# EAGLE design ps2_atmega32_ board_with connector_shogini_5_eagle7x (EAGLE 7.7.0)
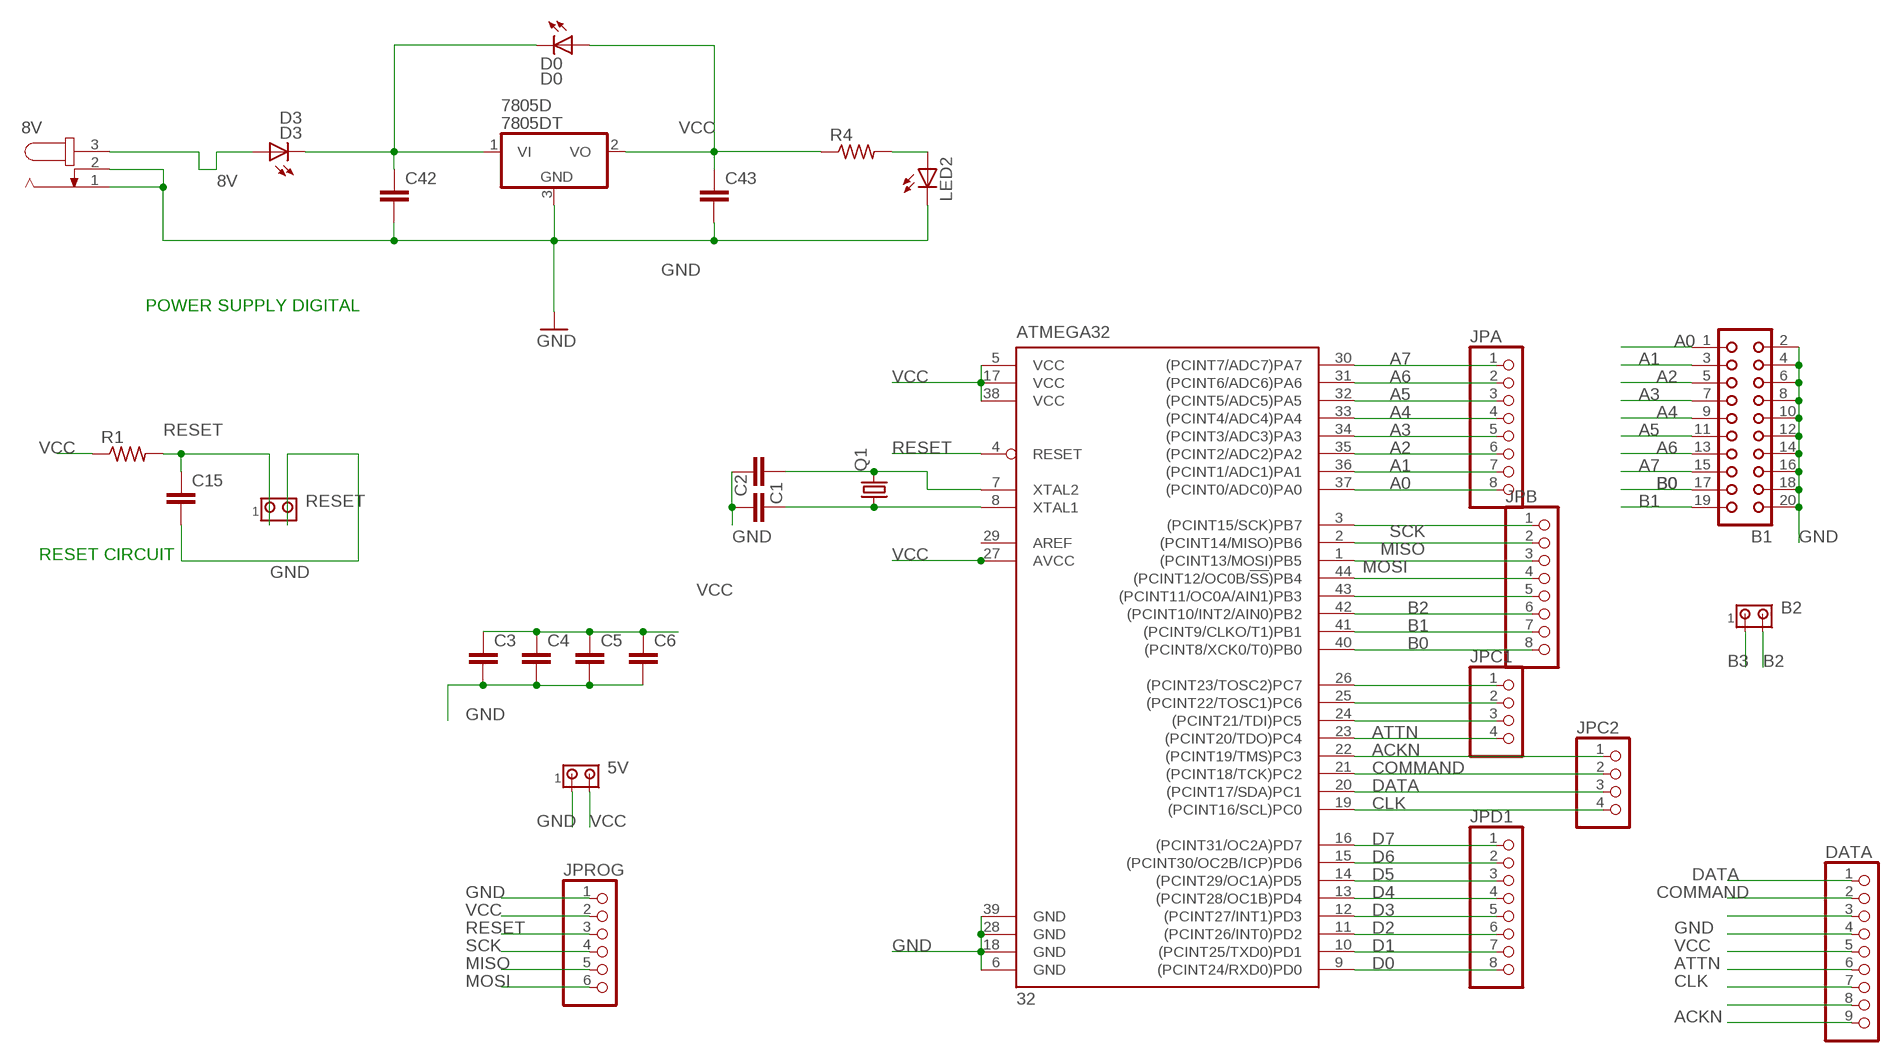
[diagram p0: schematic, sheet 1]

## Parts
5V  MTA02-100  [10X02MTA]
8V  JACK-PLUG0  [SPC4077]
7805D  7805DT  [TO252]
ATMEGA32  32  ATMEGA644A  [TQFP44]
B1  CON20L  [CON20L]
B2  MTA02-100  [10X02MTA]
C1  C-EUC0603K  [C0603K]
C2  C-EUC0603K  [C0603K]
C3  C-EUC0603K  [C0603K]
C4  C-EUC0603K  [C0603K]
C5  C-EUC0603K  [C0603K]
C6  C-EUC0603K  [C0603K]
C15  C-EUC0603  [C0603]
C42  C-EUC0603  [C0603]
C43  C-EUC0603  [C0603]
D0  D0  LEDCHIPLED_1206  [CHIPLED_1206]
D3  D3  LEDCHIPLED_1206  [CHIPLED_1206]
DATA  PINHD-1X9  [1X09]
JPA  PINHD-1X8  [1X08]
JPB  PINHD-1X8  [1X08]
JPC1  PINHD-1X4  [1X04]
JPC2  PINHD-1X4  [1X04]
JPD1  PINHD-1X8  [1X08]
JPROG  PINHD-1X6  [1X06]
LED2  LEDCHIPLED_1206  [CHIPLED_1206]
Q1  CRYSTALHC49S  [HC49/S]
R1  R-US_R0603  [R0603]
R4  R-US_R0603  [R0603]
RESET  MTA02-100  [10X02MTA]

## Nets
8V: 8V.3 D3.A
A0: ATMEGA32.37((PCINT0/ADC0)PA0) B1.1 JPA.8
A1: ATMEGA32.36((PCINT1/ADC1)PA1) B1.3 JPA.7
A2: ATMEGA32.35((PCINT2/ADC2)PA2) B1.5 JPA.6
A3: ATMEGA32.34((PCINT3/ADC3)PA3) B1.7 JPA.5
A4: ATMEGA32.33((PCINT4/ADC4)PA4) B1.9 JPA.4
A5: ATMEGA32.32((PCINT5/ADC5)PA5) B1.11 JPA.3
A6: ATMEGA32.31((PCINT6/ADC6)PA6) B1.13 JPA.2
A7: ATMEGA32.30((PCINT7/ADC7)PA7) B1.15 JPA.1
ACKN: ATMEGA32.22((PCINT19/TMS)PC3) DATA.9 JPC2.1
ATTN: ATMEGA32.23((PCINT20/TDO)PC4) DATA.6 JPC1.4
B0: ATMEGA32.40((PCINT8/XCK0/T0)PB0) B1.17 JPB.8
B1: ATMEGA32.41((PCINT9/CLKO/T1)PB1) B1.19 JPB.7
B2: ATMEGA32.42((PCINT10/INT2/AIN0)PB2) B2.2 JPB.6
B3: ATMEGA32.43((PCINT11/OC0A/AIN1)PB3) B2.1 JPB.5
CLK: ATMEGA32.19((PCINT16/SCL)PC0) DATA.7 JPC2.4
COMMAND: ATMEGA32.21((PCINT18/TCK)PC2) DATA.2 JPC2.2
D0: ATMEGA32.9((PCINT24/RXD0)PD0) JPD1.8
D1: ATMEGA32.10((PCINT25/TXD0)PD1) JPD1.7
D2: ATMEGA32.11((PCINT26/INT0)PD2) JPD1.6
D3: ATMEGA32.12((PCINT27/INT1)PD3) JPD1.5
D4: ATMEGA32.13((PCINT28/OC1B)PD4) JPD1.4
D5: ATMEGA32.14((PCINT29/OC1A)PD5) JPD1.3
D6: ATMEGA32.15((PCINT30/OC2B/ICP)PD6) JPD1.2
D7: ATMEGA32.16((PCINT31/OC2A)PD7) JPD1.1
DATA: ATMEGA32.20((PCINT17/SDA)PC1) DATA.1 JPC2.3
GND: 5V.1 8V.1 8V.2 7805D.3(GND) ATMEGA32.6(GND) ATMEGA32.18(GND) ATMEGA32.28(GND) ATMEGA32.39(GND) B1.2 B1.4 B1.6 B1.8 B1.10 B1.12 B1.14 B1.16 B1.18 B1.20 C1.2 C2.1 C3.2 C4.2 C5.2 C6.2 C15.2 C42.2 C43.2 DATA.4 JPROG.1 LED2.C RESET.2
MISO: ATMEGA32.2((PCINT14/MISO)PB6) JPB.2 JPROG.5
MOSI: ATMEGA32.1((PCINT13/MOSI)PB5) JPB.3 JPROG.6
N$1: ATMEGA32.7(XTAL2) C1.1 Q1.2
N$2: ATMEGA32.8(XTAL1) C2.2 Q1.1
N$5: DATA.3
N$8: LED2.A R4.2
N$10: DATA.8
N$14: ATMEGA32.44((PCINT12/OC0B/!SS!)PB4) JPB.4
N$19: ATMEGA32.26((PCINT23/TOSC2)PC7) JPC1.1
N$20: ATMEGA32.25((PCINT22/TOSC1)PC6) JPC1.2
N$21: ATMEGA32.24((PCINT21/TDI)PC5) JPC1.3
RESET: ATMEGA32.4(RESET) C15.1 JPROG.3 R1.2 RESET.1
SCK: ATMEGA32.3((PCINT15/SCK)PB7) JPB.1 JPROG.4
VCC: 5V.2 7805D.2(VO) ATMEGA32.5(VCC) ATMEGA32.17(VCC) ATMEGA32.27(AVCC) ATMEGA32.38(VCC) C3.1 C4.1 C5.1 C6.1 C43.1 D0.A DATA.5 JPROG.2 R1.1 R4.1
VI(5D): 7805D.1(VI) C42.1 D0.C D3.C
Unconnected: ATMEGA32.29(AREF)

## Notes on the sheet
- POWER SUPPLY DIGITAL
- RESET CIRCUIT

## Library data of the parts
5V B2 RESET = con-amp:MTA02-100: AMP connector
8V = con-jack:JACK-PLUG: DC POWER JACK Power Jack, DC, Right Angle, Through Hole, Rated 5A at 16VDC, PC Terminals Distributor: Farnell (www.Farnell.de) Drawing: 84N1161.pdf / 84N1162.pdf Manufacturer: SPC Technology (www.spctechnology.com) Type: SPC4077 / SPC 4078
7805D = linear:78*: Positive VOLTAGE REGULATOR Source: http://cache.national.com/ds/LM/LM78L05.pdf http://www.fairchildsemi.com/ds/LM/LM7805.pdf
ATMEGA32 = atmel:ATMEGA644: 8-bit Microcontroller with 64K Bytes In-System Programmable Flash Source: http://www.atmel.com/dyn/resources/prod_documents/doc2593.pdf
B1 = con-harting:CON20L: CONNECTOR
C1-C6 C15 C42 C43 = rcl:C-EU: CAPACITOR, European symbol
D0 D3 LED2 = led:LED: LED OSRAM: - CHIPLED LG R971, LG N971, LY N971, LG Q971, LY Q971, LO R971, LY R971 LH N974, LH R974 LS Q976, LO Q976, LY Q976 LO Q996 - Hyper CHIPLED LW Q18S LB Q993, LB Q99A, LB R99A - SideLED LS A670, LO A670, LY A670, LG A670, LP A670 LB A673, LV A673, LT A673, LW A673 LH A674 LY A675 LS A676, LA A676, LO A676, LY A676, LW A676 LS A679, LY A679, LG A679 - Hyper Micro SIDELED® LS Y876, LA Y876, LO Y876, LY Y876 LT Y87S - SmartLED LW L88C, LW L88S LB L89C, LB L89S, LG L890 LS L89K, LO L89K, LY L89K LS L896, LA L896, LO L896, LY L896 - TOPLED LS T670, LO T670, LY T670, LG T670, LP T670 LSG T670, LSP T670, LSY T670, LOP T670, LYG T670 LG T671, LOG T671, LSG T671 LB T673, LV T673, LT T673, LW T673 LH T674 LS T676, LA T676, LO T676, LY T676, LB T676, LH T676, LSB T676, LW T676 LB T67C, LV T67C, LT T67C, LS T67K, LO T67K, LY T67K, LW E67C LS E67B, LA E67B, LO E67B, LY E67B, LB E67C, LV E67C, LT E67C LW T67C LS T679, LY T679, LG T679 LS T770, LO T770, LY T770, LG T770, LP T770 LB T773, LV T773, LT T773, LW T773 LH T774 LS E675, LA E675, LY E675, LS T675 LS T776, LA T776, LO T776, LY T776, LB T776 LHGB T686 LT T68C, LB T68C - Hyper Mini TOPLED® LB M676 - Mini TOPLED Santana® LG M470 LS M47K, LO M47K, LY M47K Source: http://www.osram.convergy.de LUXEON: - LUMILED® LXK2-PW12-R00, LXK2-PW12-S00, LXK2-PW14-U00, LXK2-PW14-V00 LXK2-PM12-R00, LXK2-PM12-S00, LXK2-PM14-U00 LXK2-PE12-Q00, LXK2-PE12-R00, LXK2-PE12-S00, LXK2-PE14-T00, LXK2-PE14-U00 LXK2-PB12-K00, LXK2-PB12-L00, LXK2-PB12-M00, LXK2-PB14-N00, LXK2-PB14-P00, LXK2-PB14-Q00 LXK2-PR12-L00, LXK2-PR12-M00, LXK2-PR14-Q00, LXK2-PR14-R00 LXK2-PD12-Q00, LXK2-PD12-R00, LXK2-PD12-S00 LXK2-PH12-R00, LXK2-PH12-S00 LXK2-PL12-P00, LXK2-PL12-Q00, LXK2-PL12-R00 Source: www.luxeon.com KINGBRIGHT: KA-3528ASYC Source: www.kingbright.com
DATA = pinhead:PINHD-1X9: PIN HEADER
JPA JPB JPD1 = pinhead:PINHD-1X8: PIN HEADER
JPC1 JPC2 = pinhead:PINHD-1X4: PIN HEADER
JPROG = pinhead:PINHD-1X6: PIN HEADER
Q1 = crystal:CRYSTAL: CRYSTAL
R1 R4 = rcl:R-US_: RESISTOR, American symbol

## Board
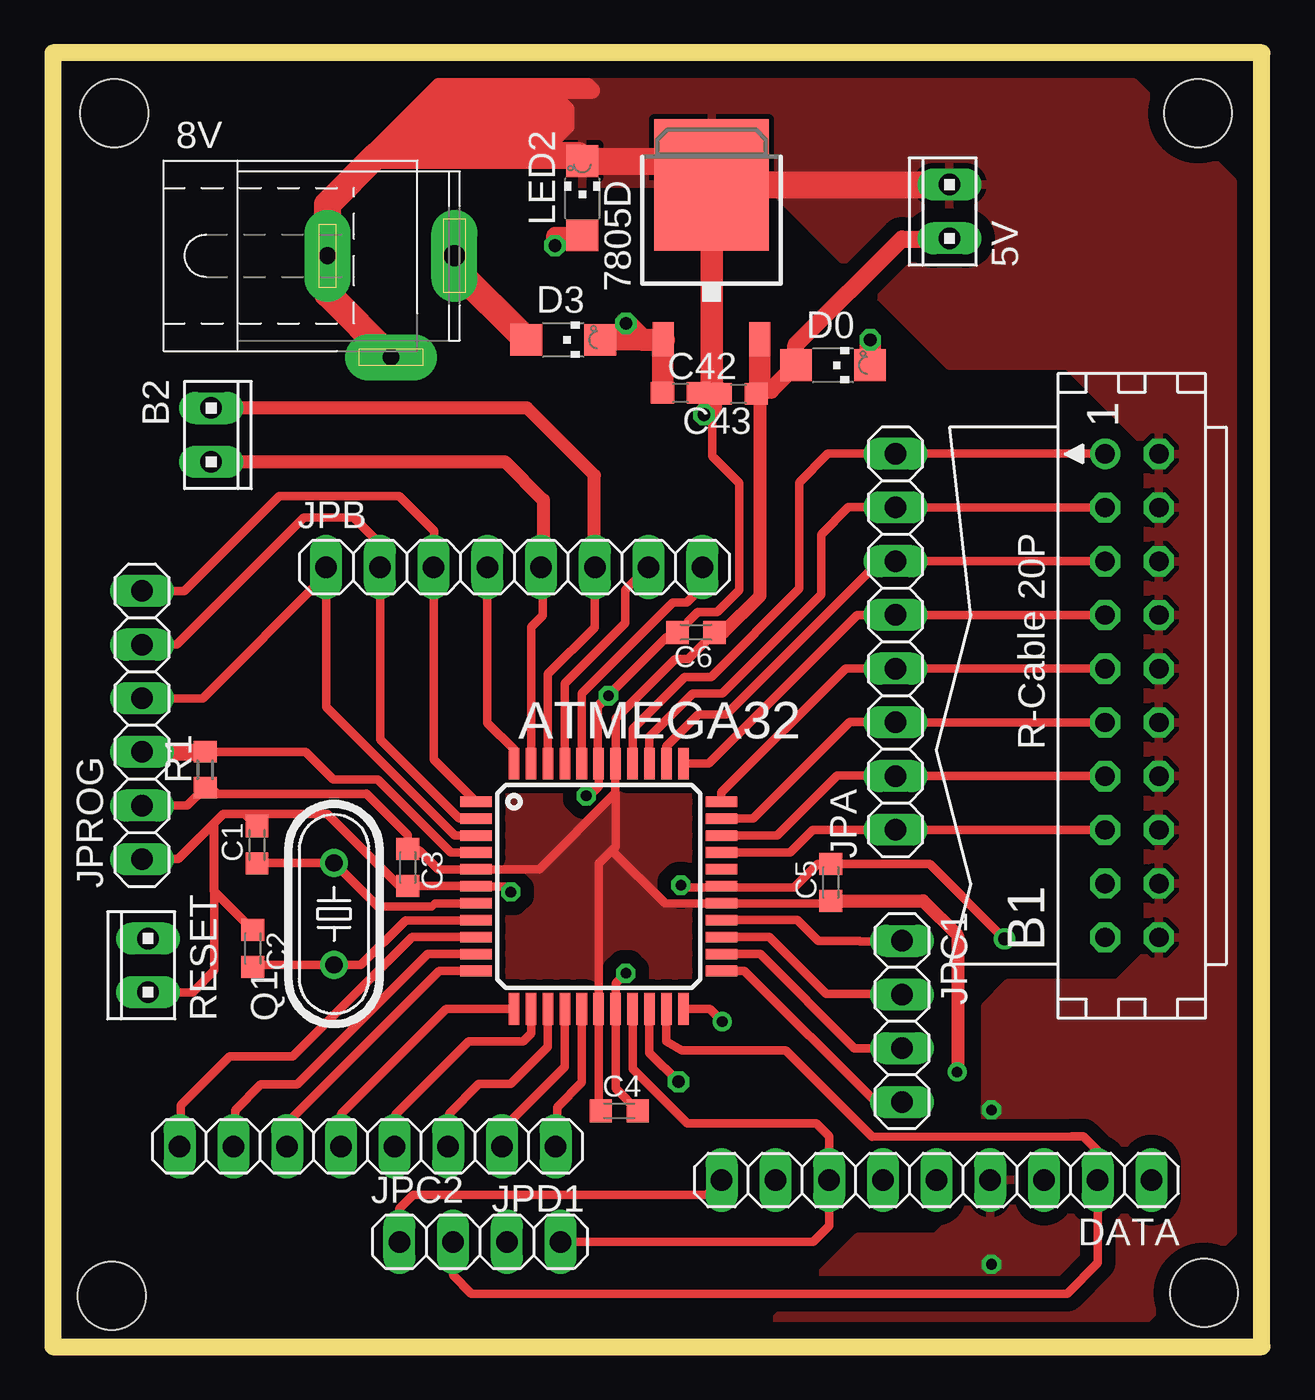
[diagram p1: board, top side]
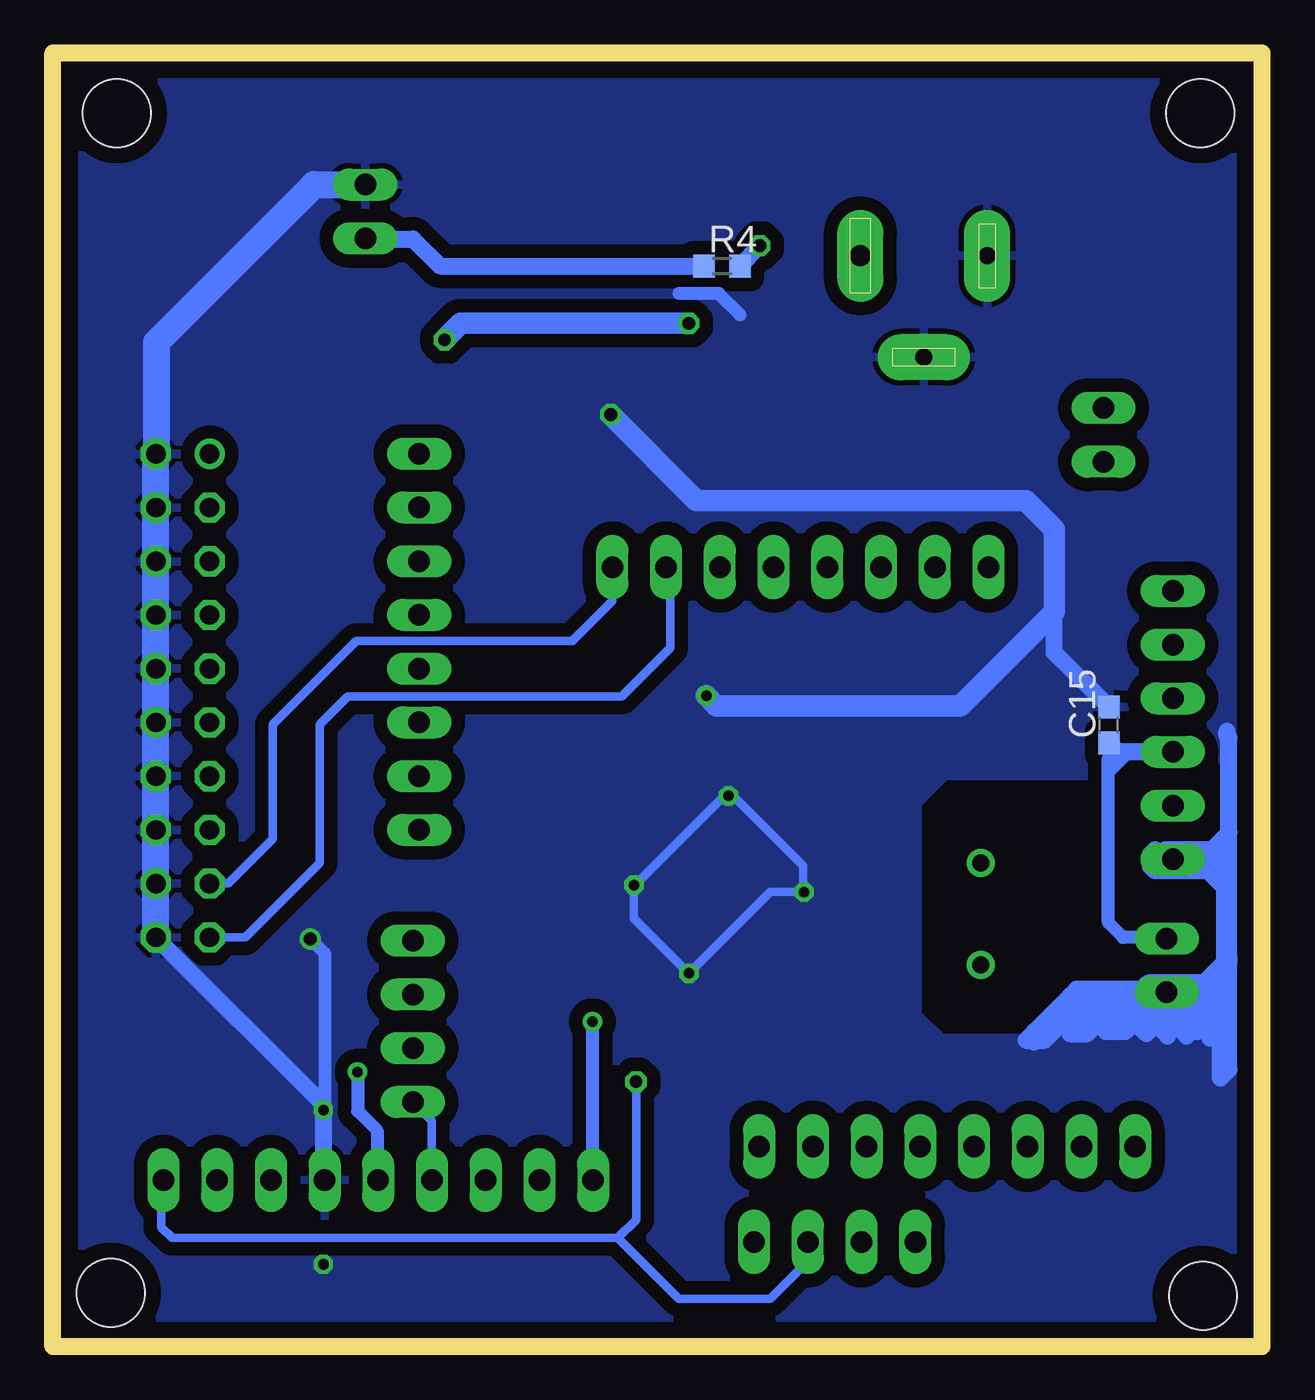
[diagram p2: board, bottom side, seen from below]

Size 57.14 x 61.17 mm. Coordinates in mm from the lower left corner, seen from the top.
Outline: 0,0 57.14,0 57.14,61.17 0,61.17 0,0
Copper layers (1*16): Top 0.035mm / dielectric 1.5mm / Bottom 0.035mm
Design rules "default *": minimum track width 10mil, minimum drill 24mil, track to track 25mil, track to pad 25mil, pad to pad 25mil, via to via 25mil, smd to smd 25mil, copper to edge 30mil, drill to drill 8mil, minimum pad ring 10mil, minimum via ring 8mil, stop-mask expansion 4mil, vias tented up to drill 0mil, thermal gap 10mil
Holes 3.2 mm at 2.91,58.32 54.12,58.32 2.79,2.4 54.4,2.55

### Footprints (pad centres in the part's own frame; a part is rotated, then mirrored left to right if it is on the bottom)
10X02MTA = drill 1.016 long: 1 1.27,0; 2 -1.27,0
SPC4077 = drill 0.8 pad 2.184 long: 1 -3,0; 2 0,-4.8 | drill 1 pad 2.184 long: 3 3,0
TO252 = smd 1 x 1.6: 1 -2.28,-4.8; 2 2.28,-4.8 | smd 5.4 x 6.2: 3 0,2.5
TQFP44 = smd 1.5 x 0.5: 1 -5.8,4; 2 -5.8,3.2; 3 -5.8,2.4; 4 -5.8,1.6; 5 -5.8,0.8; 6 -5.8,0; 7 -5.8,-0.8; 8 -5.8,-1.6; 9 -5.8,-2.4; 10 -5.8,-3.2; 11 -5.8,-4; 23 5.8,-4; 24 5.8,-3.2; 25 5.8,-2.4; 26 5.8,-1.6; 27 5.8,-0.8; 28 5.8,0; 29 5.8,0.8; 30 5.8,1.6; 31 5.8,2.4; 32 5.8,3.2; 33 5.8,4 | smd 0.5 x 1.5: 12 -4,-5.8; 13 -3.2,-5.8; 14 -2.4,-5.8; 15 -1.6,-5.8; 16 -0.8,-5.8; 17 0,-5.8; 18 0.8,-5.8; 19 1.6,-5.8; 20 2.4,-5.8; 21 3.2,-5.8; 22 4,-5.8; 34 4,5.8; 35 3.2,5.8; 36 2.4,5.8; 37 1.6,5.8; 38 0.8,5.8; 39 0,5.8; 40 -0.8,5.8; 41 -1.6,5.8; 42 -2.4,5.8; 43 -3.2,5.8; 44 -4,5.8
CON20L = drill 0.914: 1 11.43,1.27 | drill 0.914 octagon: 2 11.43,-1.27; 3 8.89,1.27; 4 8.89,-1.27; 5 6.35,1.27; 6 6.35,-1.27; 7 3.81,1.27; 8 3.81,-1.27; 9 1.27,1.27; 10 1.27,-1.27; 11 -1.27,1.27; 12 -1.27,-1.27; 13 -3.81,1.27; 14 -3.81,-1.27; 15 -6.35,1.27; 16 -6.35,-1.27; 17 -8.89,1.27; 18 -8.89,-1.27; 19 -11.43,1.27; 20 -11.43,-1.27
C0603K = smd 1.05 x 1.08: 1 -0.875,0; 2 0.875,0
C0603 = smd 1.1 x 1: 1 -0.85,0; 2 0.85,0
CHIPLED_1206 = smd 1.5 x 1.5: A 0,-1.75; C 0,1.75
1X09 = drill 1.016 long: 1 -10.16,0; 2 -7.62,0; 3 -5.08,0; 4 -2.54,0; 5 0,0; 6 2.54,0; 7 5.08,0; 8 7.62,0; 9 10.16,0
1X08 = drill 1.016 long: 1 -8.89,0; 2 -6.35,0; 3 -3.81,0; 4 -1.27,0; 5 1.27,0; 6 3.81,0; 7 6.35,0; 8 8.89,0
1X04 = drill 1.016 long: 1 -3.81,0; 2 -1.27,0; 3 1.27,0; 4 3.81,0
1X06 = drill 1.016 long: 1 -6.35,0; 2 -3.81,0; 3 -1.27,0; 4 1.27,0; 5 3.81,0; 6 6.35,0
HC49/S = drill 0.813: 1 -2.413,0; 2 2.413,0
R0603 = smd 1 x 1.1: 1 -0.85,0; 2 0.85,0

### Placement (x,y rotation side)
5V  42.37,53.67 90 top
8V  15.98,51.58 0 top
7805D  31.13,52.43 0 top
ATMEGA32  25.8,21.77 0 top
B1  51,30.78 90 top
B2  7.48,43.11 270 top
C1  9.65,23.73 90 top
C2  9.45,18.83 270 top
C3  16.78,22.65 270 top
C4  26.77,11.15 0 top
C5  36.76,21.95 90 top
C6  30.4,33.77 180 top
C15  7.22,29.39 90 bottom
C42  29.67,45.09 0 top
C43  32.4,45.05 180 top
D0  36.87,46.4 270 top
D3  24.12,47.6 270 top
DATA  41.76,7.88 180 top
JPA  39.83,33.33 90 top
JPB  21.8,36.86 0 top
JPC1  40.13,15.38 270 top
JPC2  20.19,4.95 0 top
JPD1  14.88,9.47 180 top
JPROG  4.21,29.39 90 top
LED2  25.02,54.29 0 top
Q1  13.29,20.46 90 top
R1  7.2,27.28 90 top
R4  25.51,51.09 0 bottom
RESET  4.49,18.03 90 top

### Tracks (layer width: path | path; a pad name or v marks a point on that pad's centre or on a via)
8V
  Top 1.27: 8V.3 18.98,50.99 D3.A
A0
  Top 0.406: ATMEGA32.37 27.4,29.21 29.86,31.67 31.11,31.67 35.28,35.84 35.28,40.86 36.63,42.22 JPA.8 B1.1
A1
  Top 0.406: ATMEGA32.36 28.2,28.83 30.25,30.88 31.64,30.88 36.31,35.55 36.31,38.4 37.59,39.69 JPA.7 B1.3
A2
  Top 0.406: ATMEGA32.35 29,28.38 30.5,29.88 31.82,29.88 39.08,37.14 JPA.6 | JPA.6 39.81,37.15 | JPA.6 B1.5
A3
  Top 0.406: ATMEGA32.34 31,27.57 38.02,34.59 39.82,34.59 JPA.5 B1.7
A4
  Top 0.406: ATMEGA32.33 31.6,26.2 37.47,32.07 39.82,32.07 JPA.4 B1.9
A5
  Top 0.406: ATMEGA32.32 33.11,24.97 37.67,29.53 JPA.3 B1.11
A6
  Top 0.406: ATMEGA32.31 34.23,24.17 37.06,27 39.81,27 JPA.2 B1.13
A7
  Top 0.406: ATMEGA32.30 34.86,23.37 35.92,24.43 39.82,24.43 JPA.1 B1.15
ACKN  (via drill 0.5)
  Top 0.406: ATMEGA32.22 31.04,15.97 v31.64,15.37 | JPC2.1 16.38,6.52 17.03,7.17 30.9,7.17 DATA.9
  Bottom 0.406: 31.64,7.91 DATA.9 31.6,9.72
  Bottom 0.61: 31.64,7.91 v31.64,15.37
ATTN
  Top 0.406: ATMEGA32.23 32.68,17.77 38.86,11.59 40.11,11.59 JPC1.4
  Bottom 0.406: DATA.6 39.22,10.66 JPC1.4
B0
  Top 0.406: ATMEGA32.40 25,30.88 29.31,35.18 29.96,35.18 30.73,35.96 30.73,36.82 JPB.8
  Bottom 0.406: B1.17 48.86,21.89 46.75,24 46.75,29.41 42.79,33.37 32.58,33.37 32.56,33.39 30.69,35.26 JPB.8
B1
  Top 0.406: ATMEGA32.41 24.2,31.36 27.06,34.22 27.06,35.77 JPB.7
  Bottom 0.406: B1.19 48.05,19.35 44.53,22.87 44.53,29.42 43.21,30.74 30.26,30.74 27.96,33.04 27.96,36.66 JPB.7
B2
  Top 0.406: ATMEGA32.42 23.4,31.81 25.6,34.01 25.6,36.84 JPB.6 25.59,36.88
  Top 0.61: B2.2 22.42,44.38 25.59,41.2 25.59,36.88
B3
  Top 0.406: ATMEGA32.43 22.6,34.04 23.14,34.58 23.14,36.79 JPB.5 23.19,36.97
  Top 0.61: B2.1 21.38,41.84 23.19,40.03 23.19,36.97
CLK
  Top 0.406: ATMEGA32.19 27.4,13.13 29.97,10.56 36.07,10.56 36.68,9.94 DATA.7 36.68,5.71 35.93,4.95 JPC2.4
COMMAND
  Top 0.406: ATMEGA32.21 29,14.44 29.73,14.01 34.63,14.01 38.74,9.92 48.16,9.93 48.7,9.93 49.38,9.25 DATA.2 | DATA.2 49.44,7.82 | DATA.2 49.37,7.89 | JPC2.2 18.92,3.37 19.78,2.5 47.93,2.5 49.39,3.95 DATA.2
D0
  Top 0.406: ATMEGA32.9 16.99,19.37 11.35,13.72 8.37,13.72 6.05,11.4 6.05,9.53 JPD1.8
D1
  Top 0.406: 8.57,10 8.57,9.51 JPD1.7 8.61,9.55 8.61,11.18 9.82,12.39 11.54,12.39 17.72,18.57 ATMEGA32.10
D2
  Top 0.406: ATMEGA32.11 18.26,17.77 11.09,10.6 11.09,9.49 JPD1.6
D3
  Top 0.406: ATMEGA32.12 18.6,15.96 13.64,10.99 13.64,9.5 JPD1.5
D4
  Top 0.406: ATMEGA32.13 22.61,14.82 22.23,14.44 19.65,14.44 16.18,10.96 16.18,9.5 JPD1.4
D5
  Top 0.406: ATMEGA32.14 23.4,14.17 21.65,12.41 20.14,12.41 18.74,11.02 18.74,9.52 JPD1.3
D6
  Top 0.406: ATMEGA32.15 24.2,13.23 21.22,10.25 JPD1.2
D7
  Top 0.406: 23.8,10.39 23.8,9.5 JPD1.1 23.83,9.53 23.83,11.32 25,12.49 ATMEGA32.16
DATA  (via drill 0.6)
  Top 0.406: ATMEGA32.20 28.2,13.9 v29.57,12.52
  Bottom 0.406: JPC2.3 21.46,4.04 23.24,2.26 27.55,2.26 30.43,5.14 | v29.57,12.52 29.57,6 30.43,5.14 | 30.43,5.14 51.5,5.14 52.01,5.65 52.01,7.79 DATA.1
GND  (via drill 0.5, 0.6)
  Top 0.254: v26.26,30.78 | C42.2 31.5,45.1 arc-90 C43.2
  Top 0.406: 25.81,27.55 ATMEGA32.39 25.8,26.48 25.36,26.04 v25.21,26.04 | 31.58,21.78 ATMEGA32.28 arc-90 31.53,21.7 | C6.2 30.48,34.73 31.41,34.73 32.44,35.76 32.44,40.84 31.17,42.11 31.17,45.42 | C6.2 | 27.68,11.12 C4.2 26.6,12.2 ATMEGA32.18 26.6,17.17 v27.08,17.65 | v44.98,19.28 41.43,22.82 C5.2 36.15,22.82 35.03,21.7 31.53,21.7 | C3.2 16.79,21.77 | C3.2 16.37,21.78 12.98,25.17 9.74,25.17 | 25.8,30.33 29.02,33.55 29.3,33.55 C6.2 | 9.06,25.17 8.04,25.17 7.63,24.76 | 7.6,24.73 5.92,23.05 4.22,23.05 JPROG.1 | 7.63,24.76 7.6,24.73 | C1.2 9.63,24.6 9.06,25.17 | C2.1 7.6,21.55 7.6,24.73 | RESET.2 6.6,16.76 7.63,17.78 7.63,24.76 | 9.06,25.17 9.74,25.17 | 9.74,25.17 9.76,25.19 | 29.68,21.77 v29.68,21.82 arc90 29.8,21.7 31.53,21.7 | v21.64,21.49 21.36,21.77 ATMEGA32.6 19.99,21.78 C3.2 | v26.26,30.78 25.76,30.27 25.76,27.59 25.86,27.49 25.86,27.29
  Top 0.61: 30.7,54.49 30.83,54.62 7805D.3 | 30.7,54.49 30.6,54.4 | 30.7,54.49 31.17,54.02
  Top 0.813: 15.16,56.29 15.16,56.49 18.26,59.59 25.26,59.59 25.46,59.39 18.96,59.39 16.36,56.79 23.36,56.79 24.26,57.69 24.26,58.49 23.86,58.89 19.36,58.89 17.66,57.19 18.56,57.19 19.96,58.59 22.86,58.59 23.66,57.79 23.66,58.19 23.76,58.29 23.06,58.29 22.66,58.69 20.96,58.69 19.46,57.19 20.56,57.19 21.46,58.09 22.56,58.09 23.26,57.39 21.66,57.39 21.46,57.59 21.36,57.59 21.06,57.29
  Top 1.016: 12.98,49.78 8V.1 12.91,51.64 | 30.83,54.62 30.29,54.62 29.77,54.62 | C43.2 31.17,45.42 31.17,52.26 31.21,52.31 31.21,52.6 31.12,52.69 | 31.12,52.69 31.12,53.97 | 31.12,52.69 31.12,44.5 30.94,44.32 30.94,44.23 v30.77,44.06
  Top 1.27: 8V.2 12.98,49.78 | 8V.1 12.98,54.01 15.29,56.32 24.74,56.32 arc-90 LED2.C 28.87,56.04 30.29,54.62 | 5V.1 7805D.3
  Bottom 0.406: B1.2 52.24,42.25 | DATA.4 | 44.34,7.88 44.34,7.71 | 29.68,21.77 29.68,20.25 v27.08,17.65 23.24,21.49 v21.64,21.49 21.67,21.52 21.67,22.73 24.95,26.01 v25.21,26.04 | 29.68,21.77 v29.68,21.82 | 29.68,21.77 25.36,26.08 25.2,26.08 25.17,26.05 25.14,26.05
  Bottom 0.61: DATA.4 44.29,18.6 v44.98,19.28 | 27.56,49.79 25.66,49.79 24.66,48.79
  Bottom 0.813: B1.20 44.34,11.42 44.34,7.7 44.34,7.71 | C15.2 9.81,32.83 9.81,34.74 | 1.66,29.09 1.66,28.89 1.56,28.79 1.56,24.29 | 1.56,24.29 2.36,23.49 | 2.36,23.49 4.56,23.49 5.16,22.89 2.96,22.89 2.36,23.49 | 1.56,24.29 1.56,18.39 1.76,18.19 | 2.46,17.49 2.76,17.19 5.36,17.19 5.66,16.89 | 5.66,16.89 5.66,16.49 5.36,16.19 5.36,16.59 5.66,16.89 | 5.66,16.89 8.76,16.89 9.06,16.59 | 9.06,16.59 9.06,16.09 10.76,14.39 10.76,14.89 | 9.06,16.59 10.76,14.89 | 10.76,14.89 11.16,14.49 10.26,14.49 8.26,16.49 2.66,16.49 2.46,16.29 7.56,16.29 9.06,14.79 8.26,14.79 7.26,15.79 6.46,15.79 | 6.46,15.79 2.46,15.79 | 6.46,15.79 7.36,14.89 6.46,14.89 6.16,15.19 5.86,15.19 5.46,14.79 4.86,15.39 4.86,15.09 4.46,14.69 4.46,14.89 3.86,15.49 3.86,14.99 3.56,14.69 3.56,14.89 3.06,15.39 2.76,15.39 2.56,15.59 2.56,15.39 3.06,14.89 3.06,16.69 1.56,18.19 1.56,13.09 1.96,12.69 1.96,16.99 2.06,17.09 2.06,14.99 2.46,14.59 2.46,17.49 | 2.46,17.49 1.76,18.19 | 1.76,18.19 1.76,21.79 | 2.16,22.19 2.66,22.69 2.36,22.69 2.06,22.99 2.06,22.29 2.16,22.19 | 1.76,21.79 2.16,22.19 | 1.76,21.79 1.86,21.79 2.56,22.49 5.06,22.49 5.26,22.69 5.26,23.29 5.06,23.49
  Bottom 1.016: v30.77,44.06 26.72,40.01 11.16,40.01 9.81,38.67 9.81,34.74 14.25,30.29 25.78,30.29 v26.26,30.78
  Bottom 1.27: 52.24,42.25 52.24,47.49 44.79,54.94 43.03,54.94 42.99,54.98 42.41,54.98 | B1.2 B1.4 B1.6 B1.8 B1.10 B1.12 B1.14 B1.16 B1.18 B1.20
  other vias: 44.36,11.19 44.36,3.89
  pour Top: 34.16,1.29 51.66,1.29 55.76,5.39 55.76,55.09 51.06,59.79 24.76,59.79 24.26,59.29 24.26,55.39 24.66,54.99 28.46,54.99 28.56,54.89 33.86,54.89 42.36,46.39 47.96,46.39 51.76,42.59 51.76,18.59 50.36,17.19 45.16,17.19 44.06,16.09 44.06,7.49 41.76,5.19 38.06,5.19
  pour Bottom: 2.16,59.99 1.16,58.99 1.16,28.49 2.66,26.99 14.96,26.99 16.26,25.69 16.26,15.69 15.16,14.59 2.66,14.59 1.26,13.19 1.26,2.09 2.26,1.09 55.26,1.09 56.16,1.99 56.16,58.69 54.86,59.99
MISO
  Top 0.406: JPB.2 15.42,36.82 | JPROG.5 5.85,33.2 11.86,39.21 14.21,39.21 15.44,37.98 15.44,36.87 JPB.2 | ATMEGA32.2 19.21,24.97 15.46,28.72 JPB.2
MOSI
  Top 0.406: 19.46,25.77 ATMEGA32.1 18,27.76 18,35.98 | 18,36.33 18,35.98 | 18,36.33 JPB.3 | 18,35.98 18.08,36.06 | JPROG.6 6.22,35.74 10.69,40.21 16.38,40.21 18.02,38.56 18.02,36.36 18,36.33
N$1
  Top 0.406: ATMEGA32.7 18.06,20.97 17.9,20.8 15.35,20.8 Q1.2 9.66,22.87 C1.1
N$2
  Top 0.406: Q1.1 13.24,18 | Q1.1 14.56,18.04 16.68,20.16 ATMEGA32.8 | C2.2 9.54,18.04 Q1.1
N$8  (via drill 0.6)
  Top 0.813: v23.73,52.05 23.73,52.54 LED2.A
  Bottom 0.813: R4.2 24.66,51.12 v23.73,52.05
N$14
  Top 0.406: ATMEGA32.44 21.8,28.22 20.54,29.48 JPB.4
N$19
  Top 0.406: JPC1.1 40.11,19.17 38.13,19.17 36.17,19.17 35.18,20.17 ATMEGA32.26
N$20
  Top 0.406: ATMEGA32.25 33.86,19.37 36.55,16.67 40.11,16.67 JPC1.2
N$21
  Top 0.406: ATMEGA32.24 33.43,18.57 37.89,14.11 JPC1.3
RESET
  Top 0.254: 7.17,28.09 R1.2
  Top 0.406: ATMEGA32.4 18.82,23.37 15.36,26.83 13.25,26.83 11.95,28.12 7.15,28.12 7.14,28.12
  Top 0.813: 7.17,28.09 7.14,28.12 JPROG.3
  Bottom 0.61: 7,28.09 7.26,27.83 7.26,27.14 | RESET.1 4.54,19.34 6.55,19.34 7.26,20.05 7.26,27.14 | 7.26,27.14 6.28,28.12 JPROG.3
  Bottom 0.813: C15.1 6.8,28.12 JPROG.3
SCK
  Top 0.406: JPB.1 | JPROG.4 7.07,30.66 12.91,36.5 JPB.1 | JPB.1 12.94,36.83 | ATMEGA32.3 18.99,24.17 12.91,30.24 JPB.1
VCC  (via drill 0.5)
  Top 0.406: 7805D.2 33.4,47.62 | C6.1 30.02,32.52 29.42,32.52 26.6,29.7 ATMEGA32.38 26.59,26.17 | C4.1 25.8,11.25 ATMEGA32.17 25.8,22.84 26.42,23.47 | 42.78,13.02 v42.74,12.99 42.76,13 | C5.1 36.66,20.97 ATMEGA32.27 31.58,20.95 28.94,20.95 26.42,23.47 | JPROG.2 6.35,25.58 R1.1 7.48,26.43 7.76,26.14 14.81,26.14 16.78,24.18 C3.1 16.84,23.46 17.32,23.46 18.22,22.57 ATMEGA32.5 22.98,22.57 26.59,26.17 | 26.42,23.47 26.61,23.65 26.61,26.15 26.59,26.17
  Top 0.61: C5.1 41.12,21.07 42.76,19.43 42.76,13 | C6.1 31.69,33.77 33.42,35.5 7805D.2
  Top 0.813: 33.41,45.22 33.94,45.22 D0.A 35.12,47.37 40.12,52.37 42.35,52.37 5V.2
  Top 1.016: C43.1 33.41,45.22 7805D.2
  Bottom 0.406: 41.82,7.94 DATA.5
  Bottom 0.61: v42.74,12.99 42.74,11.15 41.82,10.23 41.82,7.94
  Bottom 0.813: R4.1 38.84,51.09 40.12,52.37 42.35,52.37 5V.2
  pour Top: 21.26,26.29 21.26,17.29 21.36,17.19 30.16,17.19 30.36,17.39 30.36,26.19 30.16,26.39 21.36,26.39
VI(5D)  (via drill 0.6)
  Top 0.61: 28.83,47.6 7805D.1 28.9,47.58
  Top 0.813: D3.C 25.85,47.58
  Top 1.016: 28.83,47.6 D3.C | C42.1 28.82,47.5 28.9,47.58 27.88,47.58 v27.08,48.38 | v38.63,47.6 38.63,46.41 D0.C
  Bottom 1.016: v27.08,48.38 37.85,48.38 v38.63,47.6

### Text on the board
tStop: MIT TECH TEAM | PS2 v1.2
bStop: MIT TECH TEAM | PS2 v1.2